# Altium schematic sheet MCU_POWER.SchDoc
size A; SheetNumber: 28; SheetTotal: 30
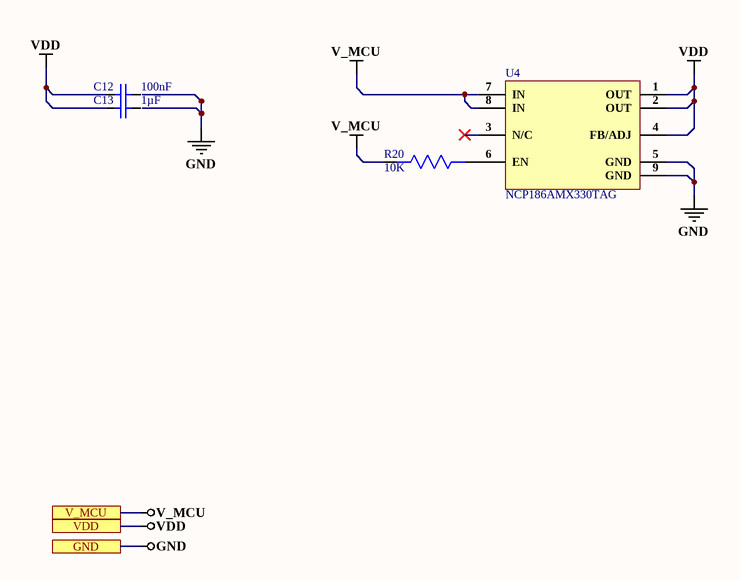
[diagram p0: MCU_POWER.SchDoc]

## Parts
C12  100nF  [Cap0402]
C13  1µF  [Cap0402]
R20  10K  [Res-0201]
U4  NCP186AMX330TAG  [NCP186AMX330TAG]

## Ports
GND, V_MCU, VDD

## Nets
GND: U4.5(GND) U4.9(GND) ; port GND
V_MCU: R20.2 U4.7(IN) U4.8(IN) ; port V_MCU
VDD: C12.2 C13.2 U4.1(OUT) U4.2(OUT) U4.4(FB/ADJ) ; port VDD
NetR20_1: R20.1 U4.6(EN)

Not connected (* = marked no-connect by the designer): C12 1; C13 1; U4 3(N/C)*

## Library data of the parts
C12 = CC0402KRX7R8BB104: CAP CER 0.1UF 25V X7R 0402; Manufacturer: Yageo; Tolerance: 10%; Dissipation Factor: 3.5%; Supplier 1: Digi-Key; Manufacturer Part Number: CC0402KRX7R8BB104; RoHS: Yes; Category: Ceramic Capacitors; Stock 1: 1841009; Pricing 1: 1=0.10000, 10=0.03100, 50=0.01700, 100=0.01390, 500=0.00990, 1000=0.00777, 2500=0.00707, 5000=0.00650 (USD); Mount: Surface Mount; Case/Package: 0402; Case Code (Imperial): 0402; Case Code (Metric): 1005; Min Operating Temperature: -55°C; Max Operating Temperature: 125°C; Capacitance: 100nF; Dielectric: X7R; Voltage Rating: 25V; Voltage Rating (DC): 25V; Packaging: Tape and Reel; Termination: SMD/SMT; Resistor Type: Ceramic; Length: 1mm; Width: 0.02inch; Height: 0.5mm; Thickness: 0.022inch; Depth: 0.5mm; Radiation Hardening: No; Lead Free: Lead Free; Halogen Free: Halogen Free; ComponentLink1URL: https://datasheet.ciiva.com/11464/upy-gphc-x7r-6-3v-to-50v-8-11464889.pdf?src-supplier=Avnet; ComponentLink1Description: https://datasheet.ciiva.com/11464/upy-gphc-x7r-6-3v-to-50v-8-11464889.pdf?src-supplier=Avnet; ComponentLink2URL: https://datasheet.ciiva.com/13210/upy-gphc-x7r-6-3v-to-50v-8-12304-13210908.pdf?src-supplier=Mouser; ComponentLink2Description: https://datasheet.ciiva.com/13210/upy-gphc-x7r-6-3v-to-50v-8-12304-13210908.pdf?src-supplier=Mouser; ComponentLink3URL: https://datasheet.ciiva.com/17437/upy-gphc-x7r-6-3v-to-50v-8-17437357.pdf?src-supplier=Avnet+Europe; ComponentLink3Description: https://datasheet.ciiva.com/17437/upy-gphc-x7r-6-3v-to-50v-8-17437357.pdf?src-supplier=Avnet+Europe; Supplier Part Number 1: 311-2077-1-ND
C13 = GRM155R61E105KA12D: CAP CER 1UF 25V X5R 0402; Manufacturer: Murata; Material: Ceramic; Tolerance: 10%; Supplier 1: Digi-Key; Manufacturer Part Number: GRM155R61E105KA12D; RoHS: Yes; Category: Ceramic Capacitors; Stock 1: 961231; Pricing 1: 1=0.11000, 10=0.08000, 50=0.04360, 100=0.03560, 500=0.02542, 1000=0.01997, 2500=0.01815, 5000=0.01670 (USD); Mount: Surface Mount; Case/Package: 0402; Case Code (Metric): 1005; Case Code (Imperial): 0402; Weight: 0.000212oz; Min Operating Temperature: -55°C; Max Operating Temperature: 85°C; Capacitance: 1uF; Voltage Rating: 25V; Packaging: Tape and Reel; Dielectric: X5R; Voltage: 25V; Termination: SMD/SMT; Voltage Rating (DC): 25V; Package Quantity: 10000; Series: GRM; Length: 1mm; Width: 0.5mm; Height: 0.5mm; Thickness: 0.022inch; Depth: 0.5mm; REACH SVHC: No SVHC; Lead Free: Lead Free; ComponentLink1URL: https://datasheet.ciiva.com/22732/1666664-22732122.pdf?src-supplier=Element14; ComponentLink1Description: https://datasheet.ciiva.com/22732/1666664-22732122.pdf?src-supplier=Element14; ComponentLink2URL: https://datasheet.ciiva.com/7719/1666664-7719006.pdf?src-supplier=Element14; ComponentLink2Description: https://datasheet.ciiva.com/7719/1666664-7719006.pdf?src-supplier=Element14; Supplier Part Number 1: 490-10017-1-ND
R20 = RC0201FR-0710KL: GENERAL 0201 11% REEL (7INCH); Manufacturer: Yageo; Temperature Coefficient: 200ppm/°C; Resistance: 10kR; Tolerance: 1%; Max Power Dissipation: 50mW; Working Voltage: 25V; Supplier 1: Digi-Key; Manufacturer Part Number: RC0201FR-0710KL; RoHS: Yes; Category: Chip SMD Resistors; Stock 1: 6892350; Pricing 1: 1=0.10000, 10=0.03600, 100=0.01480, 1000=0.00665, 2500=0.00577, 5000=0.00477 (USD); Case/Package: 0201; Number of Pins: 2; Contact Plating: Tin,Matte; Weight: 6E-06oz; Case Code (Imperial): 0201; Case Code (Metric): 0603; Min Operating Temperature: -55°C; Max Operating Temperature: 125°C; Resistor Type: Thick Film; Features: Moisture Resistant; Termination: SMD/SMT; Number of Terminations: 2; Power Rating: 50mW; Voltage Rating: 25V; Packaging: Tape and Reel; Package Quantity: 1; Voltage Rating (DC): 25V; Length: 0.6mm; Width: 0.3mm; Height: 0.01inch; Depth: 0.3mm; Radiation Hardening: No; REACH SVHC: No SVHC; Military Standard: Not; Lead Free: Lead Free; ComponentLink1URL: https://datasheet.ciiva.com/2467/pyu-r-int-thick-7-2467109.pdf?src-supplier=Digi-Key; ComponentLink1Description: https://datasheet.ciiva.com/2467/pyu-r-int-thick-7-2467109.pdf?src-supplier=Digi-Key; ComponentLink2URL: https://datasheet.ciiva.com/2467/pyu-r-int-thick-7-2467110.pdf?src-supplier=Digi-Key; ComponentLink2Description: https://datasheet.ciiva.com/2467/pyu-r-int-thick-7-2467110.pdf?src-supplier=Digi-Key; ComponentLink3URL: https://datasheet.ciiva.com/2467/pyu-r-int-thick-7-2467111.pdf?src-supplier=Digi-Key; ComponentLink3Description: https://datasheet.ciiva.com/2467/pyu-r-int-thick-7-2467111.pdf?src-supplier=Digi-Key; ComponentLink4URL: https://datasheet.ciiva.com/7660/1421516-7660807.pdf?src-supplier=Element14; ComponentLink4Description: https://datasheet.ciiva.com/7660/1421516-7660807.pdf?src-supplier=Element14; ComponentLink5URL: https://datasheet.ciiva.com/8891/pyu-rc0201-51-rohs-l-8-8891384.pdf?src-supplier=Avnet; ComponentLink5Description: https://datasheet.ciiva.com/8891/pyu-rc0201-51-rohs-l-8-8891384.pdf?src-supplier=Avnet; ComponentLink6URL: https://datasheet.ciiva.com/28405/pyu-rc0201-51-rohs-l-8-28405609.pdf?src-supplier=Avnet+Europe; ComponentLink6Description: https://datasheet.ciiva.com/28405/pyu-rc0201-51-rohs-l-8-28405609.pdf?src-supplier=Avnet+Europe; ComponentLink7URL: https://datasheet.ciiva.com/26829/getdatasheetpartid-421074-26829851.pdf?src-supplier=Verical; ComponentLink7Description: https://datasheet.ciiva.com/26829/getdatasheetpartid-421074-26829851.pdf?src-supplier=Verical; ComponentLink8URL: https://datasheet.ciiva.com/46391/1421516-46391339.pdf?src-supplier=Element14; ComponentLink8Description: https://datasheet.ciiva.com/46391/1421516-46391339.pdf?src-supplier=Element14; ComponentLink9URL: https://datasheet.ciiva.com/16855/pyu-rc0201-51-rohs-l-8-16855789.pdf?src-supplier=Avnet+Europe; ComponentLink9Description: https://datasheet.ciiva.com/16855/pyu-rc0201-51-rohs-l-8-16855789.pdf?src-supplier=Avnet+Europe; Supplier Part Number 1: 311-10.0KMCT-ND
U4 = NCP186AMX330TAG: IC REG LINEAR 3.3V 1A 8XDFN; Manufacturer: ON Semiconductor; Dropout Voltage: 95mV; Number of Regulators: 1; Min Current Limit: 1.1A; Supplier 1: Digi-Key; Manufacturer Part Number: NCP186AMX330TAG; Stock 1: 5995; Pricing 1: 1=0.48, 10=0.39, 25=0.3564, 100=0.2405, 250=0.199, 500=0.18242, 1000=0.13682 (USD); Mount: Surface Mount; Number of Pins: 8; Min Operating Temperature: -40°C; Max Operating Temperature: 125°C; Packaging: Tape and Reel; Output Voltage: 3.3V; Output Current: 1A; Lead Free: Lead Free; ComponentLink1URL: http://www.farnell.com/datasheets/2236905.pdf?src-supplier=Farnell; ComponentLink1Description: http://www.farnell.com/datasheets/2236905.pdf?src-supplier=Farnell; ComponentLink2URL: http://www.farnell.com/datasheets/2236905.pdf?src-supplier=Newark; ComponentLink2Description: http://www.farnell.com/datasheets/2236905.pdf?src-supplier=Newark; ComponentLink3URL: http://www.onsemi.com/pub/Collateral/NCP186-D.PDF?src-supplier=Digi-Key; ComponentLink3Description: http://www.onsemi.com/pub/Collateral/NCP186-D.PDF?src-supplier=Digi-Key; ComponentLink4URL: https://www.onsemi.com/pub/Collateral/NCP186-D.PDF?src-supplier=Digi-Key; ComponentLink4Description: https://www.onsemi.com/pub/Collateral/NCP186-D.PDF?src-supplier=Digi-Key; Supplier Part Number 1: NCP186AMX330TAGOSCT-ND